# Altium schematic sheet type-c.SchDoc
size A4; SheetNumber: 3; SheetTotal: 4
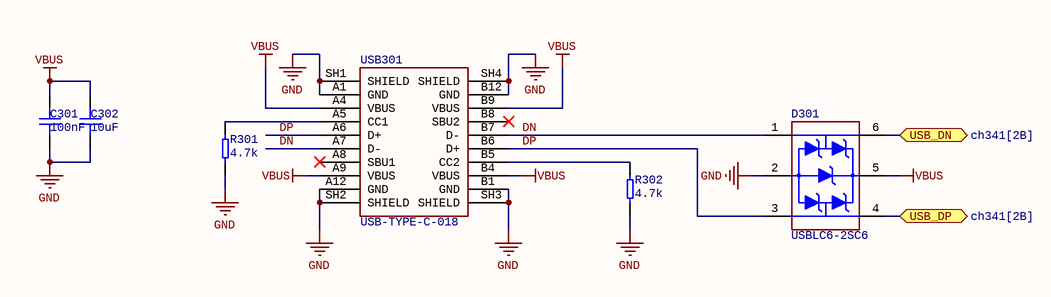
[diagram p0: type-c.SchDoc]

## Parts
C301  100nF  [fp-0005]
C302  10uF  [fp-0006]
D301  USBLC6-2SC6  [fp-0018]
R301  4.7k  [fp-0002]
R302  4.7k  [fp-0002]
USB301  USB-TYPE-C-018  [fp-0017]

## Ports
USB_DN (bidir, see ch341[2B]), USB_DP (bidir, see ch341[2B])

## Nets
GND: C301.1 C302.1 D301.2 R301.1 R302.1 USB301.A1(GND) USB301.A12(GND) USB301.B1(GND) USB301.B12(GND) USB301.SH1(SHIELD) USB301.SH2(SHIELD) USB301.SH3(SHIELD) USB301.SH4(SHIELD)
VBUS: C301.2 C302.2 D301.5 USB301.A4(VBUS) USB301.A9(VBUS) USB301.B4(VBUS) USB301.B9(VBUS)
DN: D301.1 USB301.A7(D-) USB301.B7(D-)
DP: D301.3 USB301.A6(D+) USB301.B6(D+)
USB_DN: D301.6 ; port USB_DN
USB_DP: D301.4 ; port USB_DP
NetR301_2: R301.2 USB301.A5(CC1)
NetR302_2: R302.2 USB301.B5(CC2)

Not connected (* = marked no-connect by the designer): USB301 A8(SBU1)* B8(SBU2)*

## Library data of the parts
C301 = CMP-0000024: 25V 100nF X5R ±20% 0402 Multilayer Ceramic Capacitors MLCC - SMD/SMT ROHS; MPN: TCC0402X5R104M250AT; Manufacturer: CCTC; CPN: 000000; ID: CMP-0000024; Category: Capacitors; GPN: 100nF; ComponentLink1Description: Product Link; ComponentLink2Description: Datasheet Link; LCSC PN: C359190
C302 = CMP-0000026: 10V 10uF X5R ±10% 0603 Multilayer Ceramic Capacitors MLCC - SMD/SMT ROHS; MPN: TCC0603X5R106K100CT; Manufacturer: CCTC; CPN: 000000; ID: CMP-0000026; Category: Capacitors; GPN: 10uF; ComponentLink1Description: Product Link; ComponentLink2Description: Datasheet Link; LCSC PN: C380314
D301 = CMP-0000065: 15V 6V SOT-23-6 Electrostatic and Surge Protection (TVS/ESD) ROHS; Manufacturer: UMW; CPN: 000000; ID: CMP-0000065; MPN: USBLC6-2SC6; Category: TVS/ESD; ComponentLink1Description: Product Link; ComponentLink1URL: https://www.lcsc.com/product-detail/Electrostatic-and-Surge-Protection-TVS-ESD_UMW-Youtai-Semiconductor-Co-Ltd-USBLC6-2SC6_C2687116.html; ComponentLink2Description: Datasheet Link; ComponentLink2URL: https://datasheet.lcsc.com/lcsc/2311091738_UMW-Youtai-Semiconductor-Co---Ltd--USBLC6-2SC6_C2687116.pdf; LCSC PN: C2687116
R301 R302 = CMP-0000006: 62.5mW Thick Film Resistors 50V ±100ppm/℃ ±5% 4.7kΩ 0402 Chip Resistor - Surface Mount ROHS; MPN: RTT02472JTH; Manufacturer: RALEC; CPN: 000000; ID: CMP-0000006; Category: Resistors; GPN: 4.7k; ComponentLink1Description: Product Link; ComponentLink2Description: Datasheet Link; LCSC PN: C103059
USB301 = CMP-0000023: 3A 1 Surface Mount，Right Angle 16P Female -25℃~+85℃ Type-C SMD USB Connectors ROHS; Manufacturer: DEALON; GPN: TYPEC; CPN: 000000; ID: CMP-0000023; MPN: USB-TYPE-C-018; Category: Connectors; ComponentLink1Description: Product Link; ComponentLink1URL: https://www.lcsc.com/product-detail/span-style-background-color-ff0-USB-span-Connectors_DEALON-USB-TYPE-C-018_C2927038.html; ComponentLink2Description: Datasheet Link; ComponentLink2URL: https://www.lcsc.com/datasheet/lcsc_datasheet_2201121330_DEALON-USB-TYPE-C-018_C2927038.pdf; LCSC PN: C2927038